# EAGLE design untitled (EAGLE 9.6.2)
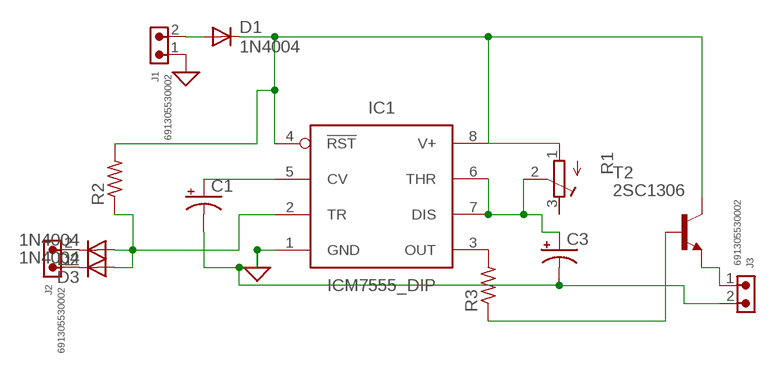
[diagram p0: schematic, sheet 1]

## Parts
C1  CAPACITOR-PE2.5-5  [E2,5-5]
C3  CAPACITOR-PE2.5-5  [E2,5-5]
D1  1N4004  [DO41-10]
D2  1N4004  [DO41-10]
D3  1N4004  [DO41-10]
IC1  ICM7555_DIP  [DIP826W53P254L959H508Q8B]
J1  691305530002  691305530002  [691305530002]
J2  691305530002  691305530002  [691305530002]
J3  691305530002  691305530002  [691305530002]
R1  R-TRIMM3296X  [RTRIM3296X]
R2  R-US_0207/7  [0207/7]
R3  R-US_0207/7  [0207/7]
T2  2SC1306  [TO220BV]

## Nets
GND: C1.- C3.- IC1.1(GND) J1.1 J3.2 ; supply symbol labelled SUP
N$1: D1.A J1.2
N$2: D1.C IC1.4(!RST) IC1.8(V+) R1.1(A) R2.2 T2.2(C)
N$3: C1.+ IC1.5(CV)
N$4: D2.C J2.2
N$5: C3.+ IC1.6(THR) IC1.7(DIS) R1.2(S)
N$6: D3.C J2.1
N$7: D2.A D3.A IC1.2(TR) R2.1
N$8: IC1.3(OUT) R3.2
N$9: R3.1 T2.1(B)
N$10: J3.1 T2.3(E)
Unconnected: R1.3(E)

## Library data of the parts
C1 C3 = BeagleBone_Blue_R3:CAPACITOR-P: POLARIZED CAPACITOR, American symbol
D1-D3 = adafruit:1N4004: DIODE General purpose 1N400x type rectifier (With bigger pads) http://www.ladyada.net/library/pcb/eaglelibrary.html
IC1 = IC_Clock-Timing:*555: TIMER 555 General purpose precision timers NE555 : Texas Datasheet <http://www.ti.com/general/docs/suppproductinfo.tsp?distId=10&gotoUrl=http%3A%2F%2Fwww.ti.com%2Flit%2Fgpn%2Fne555>, Diodes Incorporated Datasheet <https://www.diodes.com/assets/Datasheets/NE555_SA555_NA555.pdf> LM555 Datasheet <http://www.ti.com/general/docs/suppproductinfo.tsp?distId=10&gotoUrl=http%3A%2F%2Fwww.ti.com%2Flit%2Fgpn%2Flm555> LMC555 Datasheet <http://www.ti.com/general/docs/suppproductinfo.tsp?distId=10&gotoUrl=http%3A%2F%2Fwww.ti.com%2Flit%2Fgpn%2Flmc555> ICM7555 : Maxim Integrated Datasheet <https://datasheets.maximintegrated.com/en/ds/ICM7555-ICM7556.pdf>, Renesas Electronics America Inc Datasheet <https://www.renesas.com/en-us/www/doc/datasheet/icm7555-56.pdf>; CATEGORY: IC_Clock-Timing; CURRENT-SUPPLY: 60µA; DESCRIPTION: IC OSC SINGLE TIMER 1MHZ 8DIP; FREQUENCY: 1MHz; MANUFACTURER: Renesas Electronics America Inc; MPN: ICM7555IPAZ; OPERATING_TEMP: -25°C to 85°C; PART_STATUS: Active; ROHS_COMPLIANT: ROHS3 Compliant; SUB-CATEGORY: Timer
J1-J3 = Wurth_Connectors_WR-TBL Pluggable Connector:691305530002: WR-TBL Serie 3055 - 5,08 mm - PCB Header Vertical Entry with Plastic Latches KIND PROPERTIES Pitch 5.08 mm MATERIAL PROPERTIES Insulator Material PA66 Insulator Flammability Rating UL94 V-0 Insulator Color Green Terminal Material Copper Alloy Terminal Plating Tin-plated surface GENERAL INFORMATION Operating Temperature -40 up to +105 °C ELECTRICAL PROPERTIES IR UL 16 A Working Voltage [UL] 300 V (AC) Withstanding Voltage [UL] 2500 V (AC) Contact Resistance [UL] 20 mΩ CERTIFICATION UL Approval E315414 <https://www.we-online.com/catalog/media/o135349v209%20Family_WR-TBL3_6913055300xx.jpg> Details see: https://www.we-online.com/catalog/en/TBL_5_08_3055_6913055300XX/ Updated by Ella Wu 2019-12-30 2019(C) Wurth Elektronik; DATASHEET-URL: https://www.we-online.com/catalog/datasheet/691305530002.pdf; IR-UL: 16A; MOUNT: THT; PART-NUMBER: 691305530002; PINS: 2; PITCH: 5.08mm; TYPE: Vertical; WORKING-VOLTAGE-UL: 300V (AC)
R1 = rcl:R-TRIMM: Trimm resistor; SPICEMODEL: X; SPICEPREFIXL: POT
R2 R3 = adafruit:R-US_: RESISTOR, American symbol
T2 = transistor-neu-to92:2SC1306: NPN Transistor Final RF Power Outupt Source: 2sc1306.pdf

## Board
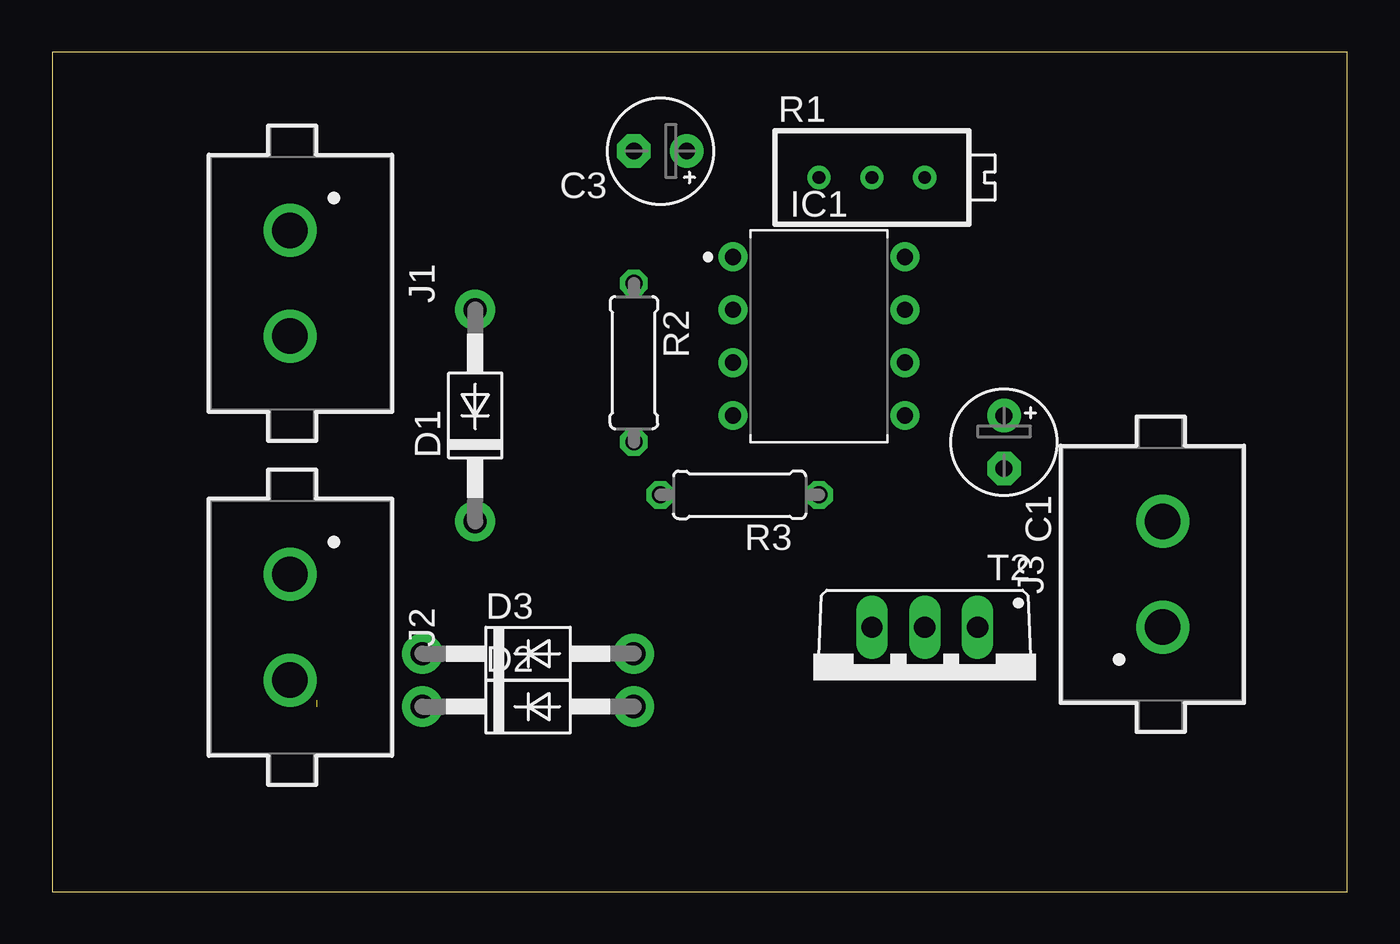
[diagram p1: board, top side]
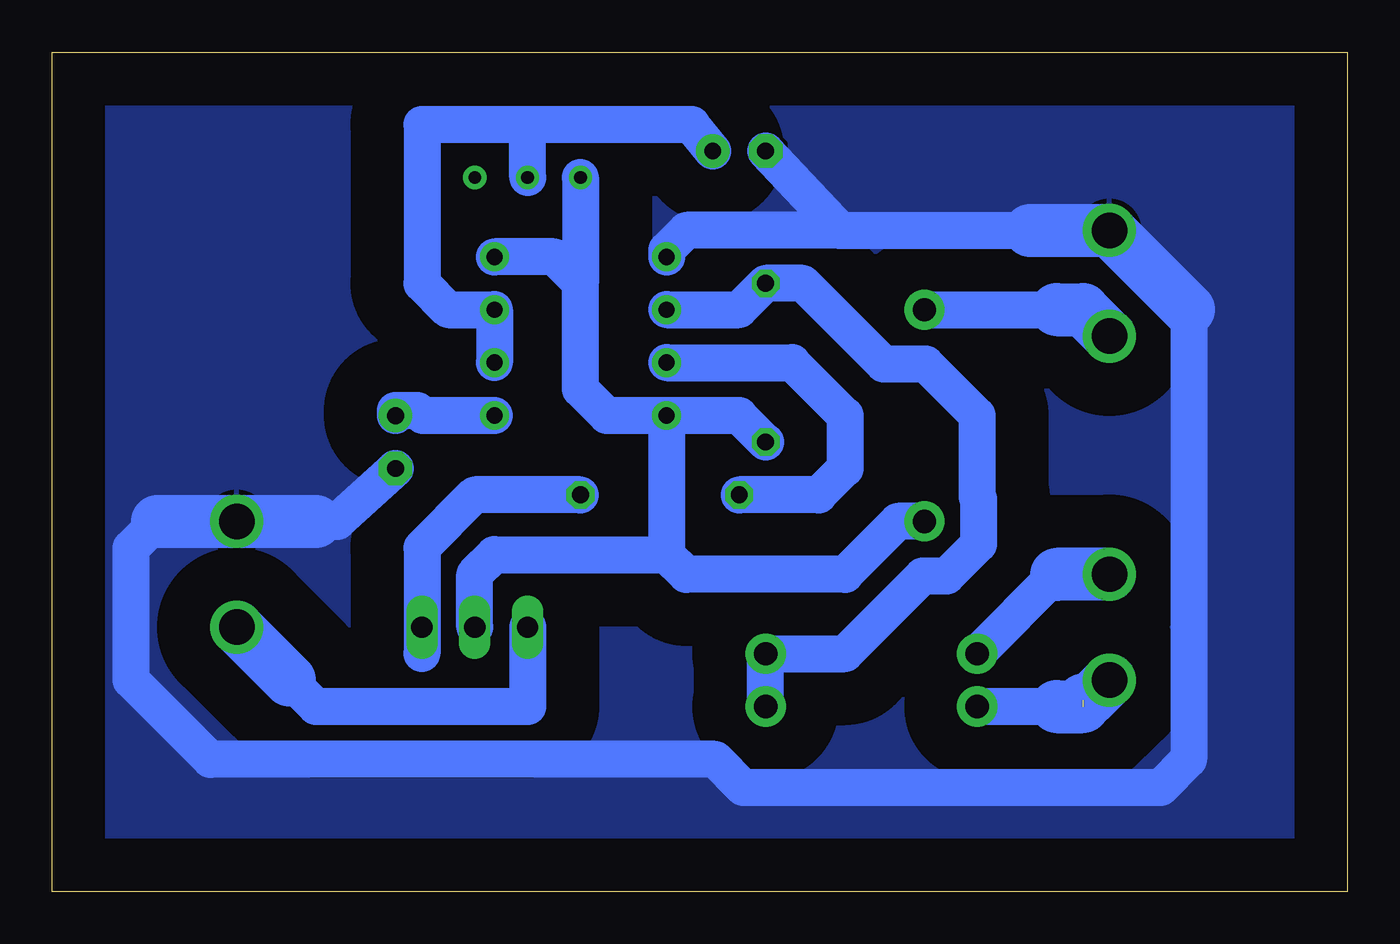
[diagram p2: board, bottom side, seen from below]

Size 62.21 x 40.31 mm. Coordinates in mm from the lower left corner, seen from the top.
Outline: 0,0 62.21,0 62.21,40.31 0,40.31 0,0
Copper layers (1*16): Top 0.035mm / dielectric 1.5mm / Bottom 0.035mm
Design rules "default *": minimum track width 6mil, minimum drill 0.35mm, track to track 30mil, track to pad 30mil, pad to pad 30mil, via to via 30mil, smd to smd 6mil, copper to edge 40mil, drill to drill 6mil, minimum pad ring 10mil, minimum via ring 8mil, stop-mask expansion 4mil, vias tented up to drill 0mil, thermal gap 10mil

### Footprints (pad centres in the part's own frame; a part is rotated, then mirrored left to right if it is on the bottom)
E2,5-5 = drill 0.813 pad 1.6: + -1.27,0 | drill 0.813 pad 1.6 octagon: - 1.27,0
DO41-10 = drill 1.118 pad 1.93: A 5.08,0; C -5.08,0
DIP826W53P254L959H508Q8B = drill 0.786 pad 1.386: 1 -4.13,3.81; 2 -4.13,1.27; 3 -4.13,-1.27; 4 -4.13,-3.81; 5 4.13,-3.81; 6 4.13,-1.27; 7 4.13,1.27; 8 4.13,3.81
691305530002 = drill 1.7: 1 -2.54,0; 2 2.54,0
RTRIM3296X = drill 0.61: 1 0,-2.54; 2 0,0; 3 0,2.54
0207/7 = drill 0.813 octagon: 1 -3.81,0; 2 3.81,0
TO220BV = drill 1.016 long: 1 -2.54,-2.54; 2 0,-2.54; 3 2.54,-2.54

### Placement (x,y rotation side)
C1  45.72,21.59 270 top
C3  29.21,35.56 180 top
D1  20.32,22.86 90 top
D2  22.86,8.89 0 top
D3  22.86,11.43 0 top
IC1  36.83,26.67 0 top
J1  11.43,29.21 270 top
J2  11.43,12.7 270 top
J3  53.34,15.24 90 top
R1  39.37,34.29 270 top
R2  27.94,25.4 270 top
R3  33.02,19.05 180 top
T2  41.91,10.16 180 top

### Tracks (layer width: path | path; a pad name or v marks a point on that pad's centre or on a via)
GND
  Bottom 1.778: 24.38,31.75 15.24,31.75 | 24.38,31.75 31.75,31.75 32.7,30.8 IC1.1 | C1.- 48.51,17.78 49.53,17.78 J3.2 57.15,17.78 58.42,16.51 58.42,10.16 54.61,6.35 30.37,6.35 29.02,5 8.97,5 7.62,6.35 7.62,27.94 | C3.- 24.38,31.75
  Bottom 2.54: 15.24,31.75 J1.1 7.62,27.94 | 57.15,17.78 49.53,17.78
  pour Bottom (isolate 2.54): 0,40.64 62.23,40.64 62.23,0 0,0
N$1
  Bottom 1.778: D1.A 13.97,27.94
  Bottom 2.54: 13.97,27.94 12.7,27.94 J1.2
N$2
  Bottom 1.778: D1.C 21.59,17.78 24.13,15.24 31.75,15.24 32.7,16.19 | R2.2 29.21,22.86 IC1.4 | IC1.4 32.7,16.19 | T2.2 41.91,15.24 40.96,16.19 32.7,16.19 | IC1.4 35.56,22.86 36.83,24.13 36.83,29.21 | 36.83,29.21 38.1,30.48 IC1.8 | R1.1 36.83,29.21
N$3
  Bottom 1.016: 45.47,22.86 C1.+
  Bottom 1.778: IC1.5 44.41,22.86 44.67,23.11 45.72,23.11 C1.+
N$4  (1 unrouted)
  Bottom 1.778: 13.97,8.89 D2.C
  Bottom 2.54: J2.2 12.39,9.2 12.7,9.2 | 13.97,8.89 12.7,8.89
N$5
  Bottom 1.778: IC1.6 IC1.7 43.18,27.94 44.45,29.21 44.45,36.83 39.37,36.83 | R1.2 39.37,36.83 | C3.+ 31.5,36.83 39.37,36.83
N$6
  Bottom 1.778: 13.97,15.24 D3.C
  Bottom 2.54: J2.1 13.97,15.24
N$7
  Bottom 1.778: D2.A D3.A 24.13,11.43 20.4,15.16 19.24,15.16 17.7,16.7 17.7,18.86 17.78,18.94 17.78,22.86 20.24,25.32 22.27,25.32 26.16,29.21 R2.1 29.21,27.94 IC1.2
N$8
  Bottom 1.778: IC1.3 26.67,25.4 24.13,22.86 24.13,20.32 25.4,19.05 R3.2
N$9
  Bottom 1.016: T2.1 44.45,16.51
  Bottom 1.778: R3.1 41.91,19.05 44.45,16.51 44.45,11.43
N$10
  Bottom 1.778: T2.3 39.37,8.89 49.53,8.89 50.8,10.16
  Bottom 2.54: J3.1 50.8,10.16